# EAGLE design 5VAC TO DC (EAGLE 9.6.2)
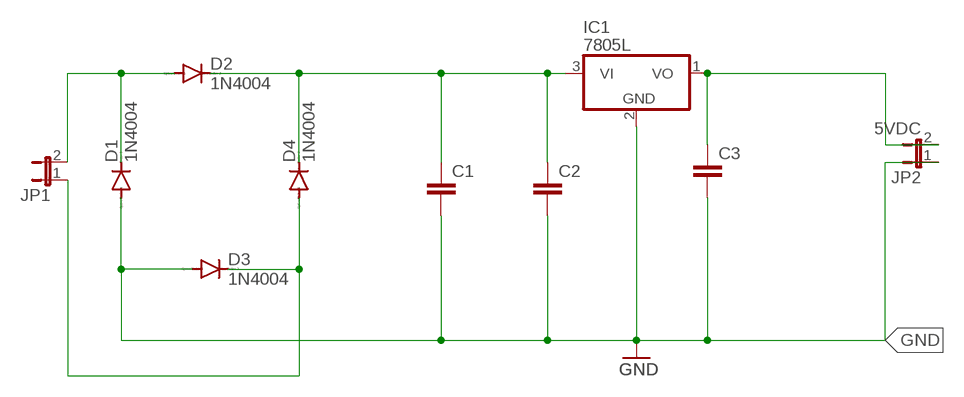
[diagram p0: schematic, sheet 1]

## Parts
C1  C2,5-3  [C2.5-3]
C2  C2,5-3  [C2.5-3]
C3  C2,5-3  [C2.5-3]
D1  1N4004  [DO41-10]
D2  1N4004  [DO41-10]
D3  1N4004  [DO41-10]
D4  1N4004  [DO41-10]
IC1  7805L  [TO92]
JP1  JP1E  [JP1]
JP2  5VDC  JP1E  [JP1]

## Nets
GND: C1.2 C2.2 C3.2 D1.A D3.A IC1.2(GND) JP2.1
N$1: D1.C D2.A JP1.2
N$2: C1.1 C2.1 D2.C D4.C IC1.3(VI)
N$3: C3.1 IC1.1(VO) JP2.2
N$5: D3.C D4.A JP1.1

## Library data of the parts
C1-C3 = capacitor-wima:C: CAPACITOR naming: grid - package width
D1-D4 = diode:1N4004: DIODE general purpose rectifier, 1 A
IC1 = linear:78*: Positive VOLTAGE REGULATOR Source: http://cache.national.com/ds/LM/LM78L05.pdf http://www.fairchildsemi.com/ds/LM/LM7805.pdf
JP1 JP2 = jumper:JP1E: JUMPER

## Board
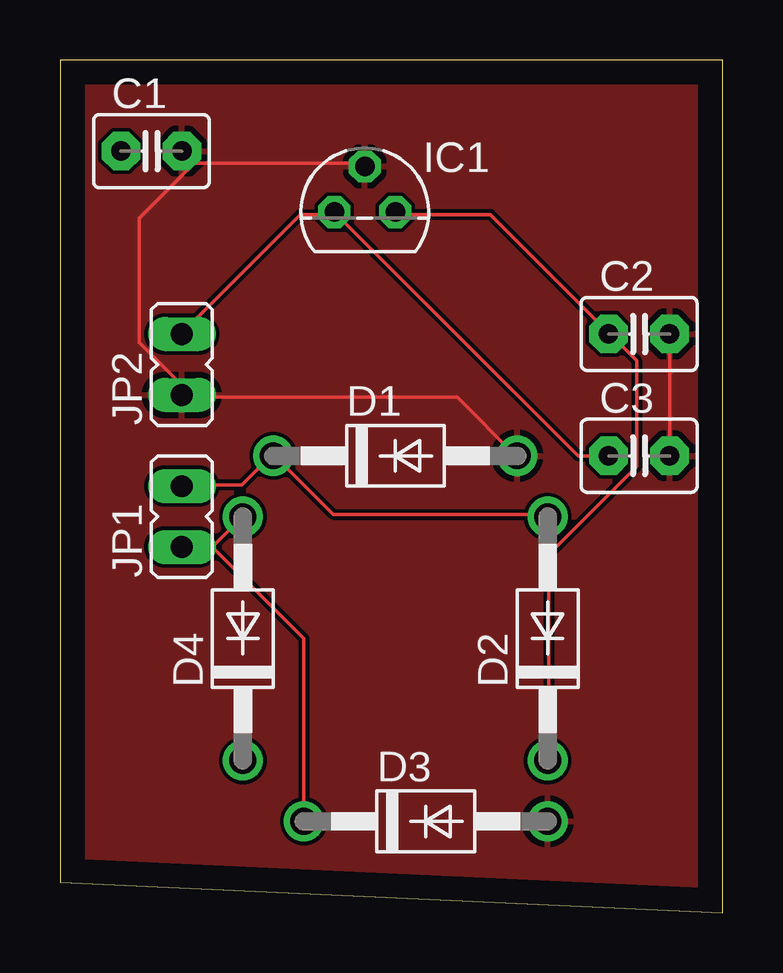
[diagram p1: board, top side]
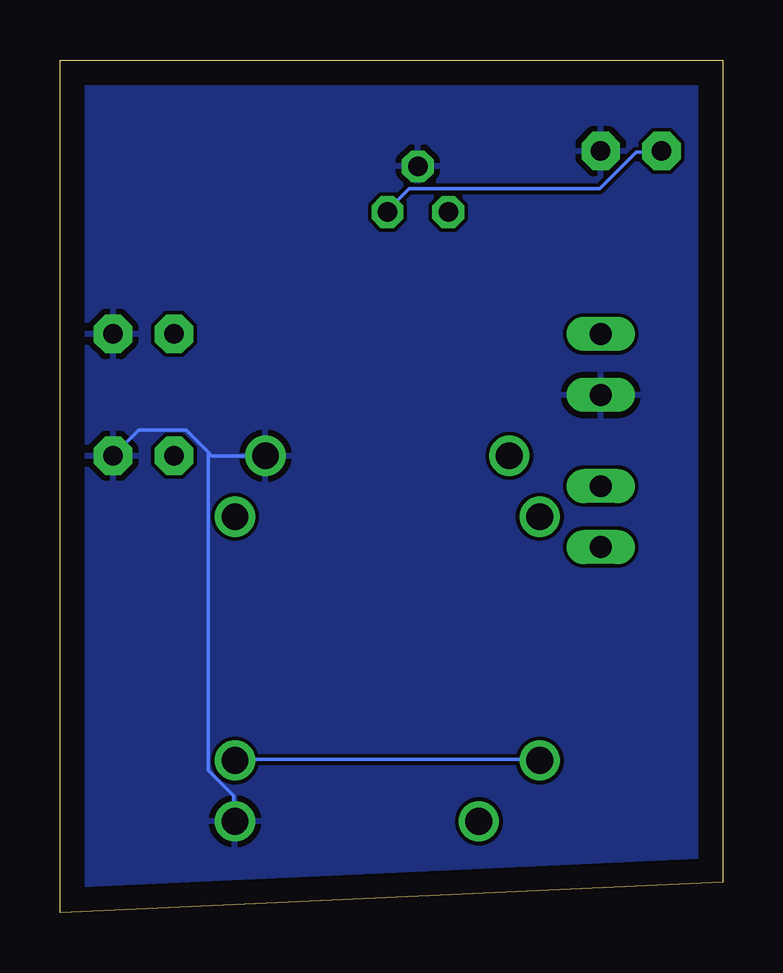
[diagram p2: board, bottom side, seen from below]

Size 27.61 x 35.55 mm. Coordinates in mm from the lower left corner, seen from the top.
Outline: 0,1.27 27.61,0 27.61,35.55 0,35.55 0,1.27
Copper layers (1*16): Top 0.035mm / dielectric 1.5mm / Bottom 0.035mm
Design rules "default": minimum track width 6mil, minimum drill 0.35mm, track to track 6mil, track to pad 6mil, pad to pad 6mil, via to via 6mil, smd to smd 6mil, copper to edge 40mil, drill to drill 6mil, minimum pad ring 10mil, minimum via ring 8mil, stop-mask expansion 4mil, vias tented up to drill 0mil, thermal gap 10mil

### Footprints (pad centres in the part's own frame; a part is rotated, then mirrored left to right if it is on the bottom)
C2.5-3 = drill 0.813 pad 1.6 octagon: 1 -1.27,0; 2 1.27,0
DO41-10 = drill 1.118: A 5.08,0; C -5.08,0
TO92 = drill 0.813 octagon: 1 -1.27,0; 2 0,1.905; 3 1.27,0
JP1 = drill 0.914 long: 1 0,-1.27; 2 0,1.27

### Placement (x,y rotation side)
C1  3.81,31.75 0 top
C2  24.13,24.13 0 top
C3  24.13,19.05 0 top
D1  13.97,19.05 0 top
D2  20.32,11.43 90 top
D3  15.24,3.81 0 top
D4  7.62,11.43 90 top
IC1  12.7,29.21 0 top
JP1  5.08,16.51 0 top
JP2  5.08,22.86 0 top

### Tracks (layer width: path | path; a pad name or v marks a point on that pad's centre or on a via)
GND
  Top 0.152: 5.59,31.24 12.6,31.24 IC1.2 | 5.59,31.24 C1.2 5.13,31.7 | 5.59,31.24 3.3,28.96 3.3,23.77 4.98,22.1 4.98,21.64 JP2.1 5.13,21.49 16.56,21.49 19,19.05 D1.A | C2.2 C3.2
  Bottom 0.152: D1.A 21.29,19.05 21.44,19.2 | 21.44,19.2 22.35,20.12 24.33,20.12 C3.2 | 21.44,19.2 21.44,5.94 20.37,4.88 20.37,3.81 D3.A
  pour Top: -1.27,38.1 29.21,38.1 29.21,-1.27 -1.27,-1.27
  pour Bottom: -2.54,40.64 30.48,40.64 30.48,-3.81 -2.54,-3.81
N$1
  Top 0.152: JP1.2 5.13,17.83 7.57,17.83 8.79,19.05 D1.C 8.94,19.05 11.38,16.61 20.22,16.61 D2.A
N$2
  Top 0.152: IC1.3 13.97,29.11 17.93,29.11 22.81,24.23 C2.1 22.96,24.08 24.03,23.01 24.03,18.59 20.37,14.93 20.37,6.4 D2.C
  Bottom 0.152: D4.C 7.72,6.4 20.22,6.4 D2.C | C1.1 2.54,31.7 3.61,31.7 5.13,30.18 13.06,30.18 13.97,29.26 IC1.3
N$3
  Top 0.152: JP2.2 5.13,24.23 10.01,29.11 11.38,29.11 IC1.1 21.59,19.05 C3.1
N$5
  Top 0.152: D4.A 6.35,15.24 | D3.C 10.16,11.43 6.35,15.24 | 6.35,15.24 JP1.1